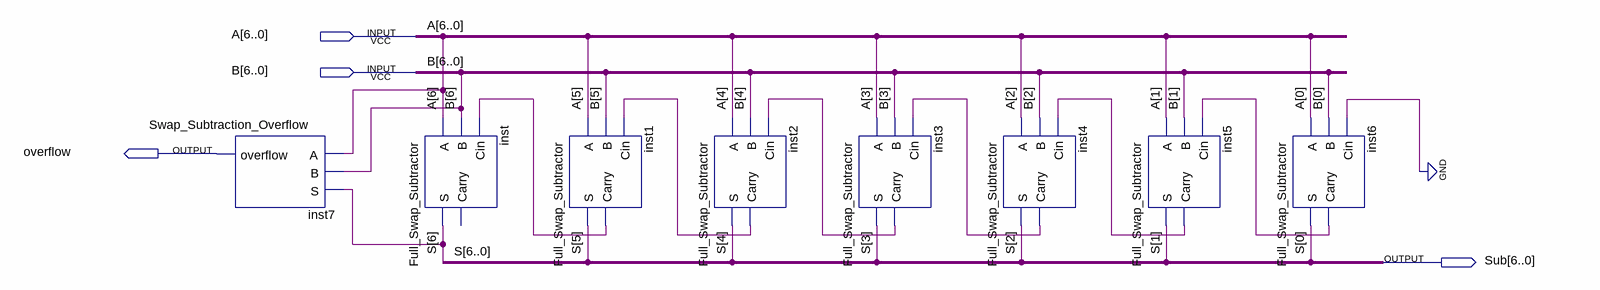
[diagram p0: schematic sheet]
// Quartus schematic Seven_bit_Swap_Subtractor.bdf as structural Verilog: 8 symbols, 4 pins
module Seven_bit_Swap_Subtractor (
  input  [6:0] A,
  input  [6:0] B,
  output overflow,
  output [6:0] Sub
);

  wire inst1_carry, inst2_carry, inst3_carry, inst4_carry, inst5_carry, inst6_carry;

  Swap_Subtraction_Overflow inst7 (.A(A[6]), .B(B[6]), .S(Sub[6]), .overflow(overflow));
  Full_Swap_Subtractor inst (.A(A[6]), .B(B[6]), .Cin(inst1_carry), .S(Sub[6]));  // open: Carry
  Full_Swap_Subtractor inst1 (.A(A[5]), .B(B[5]), .Cin(inst2_carry), .S(Sub[5]), .Carry(inst1_carry));
  Full_Swap_Subtractor inst2 (.A(A[4]), .B(B[4]), .Cin(inst3_carry), .S(Sub[4]), .Carry(inst2_carry));
  Full_Swap_Subtractor inst3 (.A(A[3]), .B(B[3]), .Cin(inst4_carry), .S(Sub[3]), .Carry(inst3_carry));
  Full_Swap_Subtractor inst4 (.A(A[2]), .B(B[2]), .Cin(inst5_carry), .S(Sub[2]), .Carry(inst4_carry));
  Full_Swap_Subtractor inst5 (.A(A[1]), .B(B[1]), .Cin(inst6_carry), .S(Sub[1]), .Carry(inst5_carry));
  Full_Swap_Subtractor inst6 (.A(A[0]), .B(B[0]), .Cin(1'b0), .S(Sub[0]), .Carry(inst6_carry));

  // Other names for the same wires on the sheet: S[6:0] = Sub
endmodule
